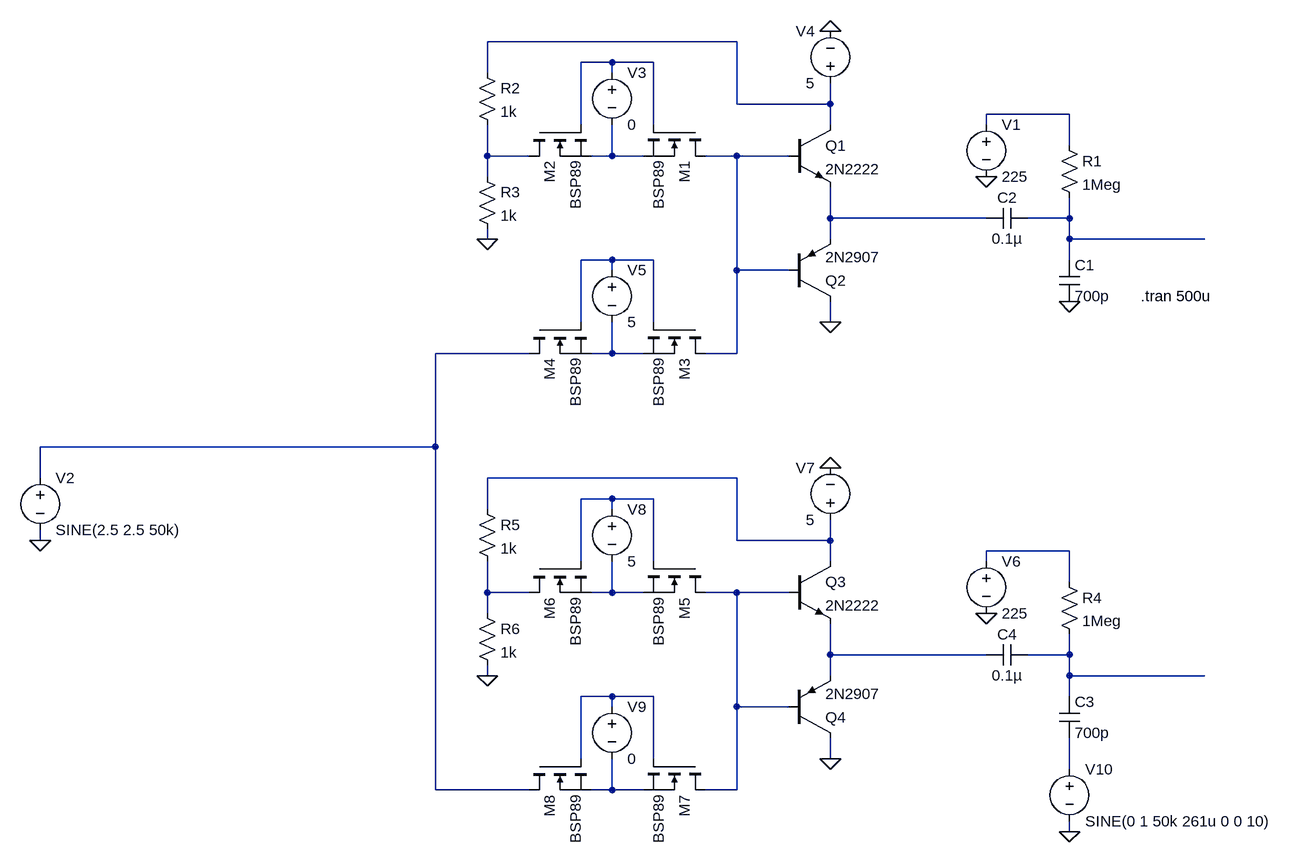
[diagram p0: schematic Ultrasonic.asc]
Ultrasonic.asc, the LTspice schematic file:
Version 4
SHEET 1 880 1064
WIRE -320 -176 -704 -176
WIRE -512 -144 -560 -144
WIRE -448 -144 -512 -144
WIRE -704 -128 -704 -176
WIRE -512 -128 -512 -144
WIRE -320 -80 -320 -176
WIRE -176 -80 -176 -112
WIRE -176 -80 -320 -80
WIRE 192 -64 64 -64
WIRE -560 -48 -560 -144
WIRE -448 -48 -448 -144
WIRE -176 -48 -176 -80
WIRE 64 -48 64 -64
WIRE 192 -16 192 -64
WIRE -704 0 -704 -48
WIRE -640 0 -704 0
WIRE -512 0 -512 -48
WIRE -512 0 -544 0
WIRE -464 0 -512 0
WIRE -320 0 -368 0
WIRE -240 0 -320 0
WIRE -704 32 -704 0
WIRE -176 96 -176 48
WIRE 64 96 -176 96
WIRE 192 96 192 64
WIRE 192 96 128 96
WIRE -704 128 -704 112
WIRE -176 128 -176 96
WIRE 192 128 192 96
WIRE 400 128 192 128
WIRE -512 160 -560 160
WIRE -448 160 -512 160
WIRE 192 160 192 128
WIRE -512 176 -512 160
WIRE -320 176 -320 0
WIRE -240 176 -320 176
WIRE -560 256 -560 160
WIRE -448 256 -448 160
WIRE -176 256 -176 224
WIRE -640 304 -784 304
WIRE -512 304 -512 256
WIRE -512 304 -544 304
WIRE -464 304 -512 304
WIRE -320 304 -320 176
WIRE -320 304 -368 304
WIRE -784 448 -784 304
WIRE -784 448 -1392 448
WIRE -1392 496 -1392 448
WIRE -320 496 -704 496
WIRE -512 528 -560 528
WIRE -448 528 -512 528
WIRE -704 544 -704 496
WIRE -512 544 -512 528
WIRE -1392 592 -1392 576
WIRE -320 592 -320 496
WIRE -176 592 -176 560
WIRE -176 592 -320 592
WIRE 192 608 64 608
WIRE -560 624 -560 528
WIRE -448 624 -448 528
WIRE -176 624 -176 592
WIRE 64 624 64 608
WIRE 192 656 192 608
WIRE -704 672 -704 624
WIRE -640 672 -704 672
WIRE -512 672 -512 624
WIRE -512 672 -544 672
WIRE -464 672 -512 672
WIRE -320 672 -368 672
WIRE -240 672 -320 672
WIRE -704 704 -704 672
WIRE -176 768 -176 720
WIRE 64 768 -176 768
WIRE 192 768 192 736
WIRE 192 768 128 768
WIRE -704 800 -704 784
WIRE -176 800 -176 768
WIRE 192 800 192 768
WIRE 400 800 192 800
WIRE -512 832 -560 832
WIRE -448 832 -512 832
WIRE 192 832 192 800
WIRE -512 848 -512 832
WIRE -320 848 -320 672
WIRE -240 848 -320 848
WIRE -560 928 -560 832
WIRE -448 928 -448 832
WIRE -176 928 -176 896
WIRE 192 944 192 896
WIRE -784 976 -784 448
WIRE -640 976 -784 976
WIRE -512 976 -512 928
WIRE -512 976 -544 976
WIRE -464 976 -512 976
WIRE -320 976 -320 848
WIRE -320 976 -368 976
WIRE 192 1040 192 1024
FLAG 64 32 0
FLAG 192 224 0
FLAG -1392 592 0
FLAG -176 -192 0
FLAG -176 256 0
FLAG -704 128 0
FLAG 64 704 0
FLAG -176 480 0
FLAG -176 928 0
FLAG -704 800 0
FLAG 192 1040 0
SYMBOL cap 176 160 R0
SYMATTR InstName C1
SYMATTR Value 700p
SYMBOL res 176 -32 R0
SYMATTR InstName R1
SYMATTR Value 1Meg
SYMBOL voltage 64 -64 R0
SYMATTR InstName V1
SYMATTR Value 225
SYMBOL cap 128 80 R90
WINDOW 0 0 32 VBottom 2
WINDOW 3 32 32 VTop 2
SYMATTR InstName C2
SYMATTR Value 0.1µ
SYMBOL voltage -1392 480 R0
WINDOW 123 0 0 Left 2
WINDOW 39 0 0 Left 2
SYMATTR InstName V2
SYMATTR Value SINE(2.5 2.5 50k)
SYMBOL npn -240 -48 R0
SYMATTR InstName Q1
SYMATTR Value 2N2222
SYMBOL pnp -240 224 M180
SYMATTR InstName Q2
SYMATTR Value 2N2907
SYMBOL voltage -176 -96 R180
WINDOW 0 24 96 Left 2
WINDOW 3 24 16 Left 2
SYMATTR InstName V4
SYMATTR Value 5
SYMBOL nmos -368 -48 R90
SYMATTR InstName M1
SYMATTR Value BSP89
SYMBOL nmos -640 -48 M90
SYMATTR InstName M2
SYMATTR Value BSP89
SYMBOL voltage -512 -144 R0
SYMATTR InstName V3
SYMATTR Value 0
SYMBOL res -720 -144 R0
SYMATTR InstName R2
SYMATTR Value 1k
SYMBOL res -720 16 R0
SYMATTR InstName R3
SYMATTR Value 1k
SYMBOL nmos -368 256 R90
SYMATTR InstName M3
SYMATTR Value BSP89
SYMBOL nmos -640 256 M90
SYMATTR InstName M4
SYMATTR Value BSP89
SYMBOL voltage -512 160 R0
SYMATTR InstName V5
SYMATTR Value 5
SYMBOL cap 176 832 R0
SYMATTR InstName C3
SYMATTR Value 700p
SYMBOL res 176 640 R0
SYMATTR InstName R4
SYMATTR Value 1Meg
SYMBOL voltage 64 608 R0
SYMATTR InstName V6
SYMATTR Value 225
SYMBOL cap 128 752 R90
WINDOW 0 0 32 VBottom 2
WINDOW 3 32 32 VTop 2
SYMATTR InstName C4
SYMATTR Value 0.1µ
SYMBOL npn -240 624 R0
SYMATTR InstName Q3
SYMATTR Value 2N2222
SYMBOL pnp -240 896 M180
SYMATTR InstName Q4
SYMATTR Value 2N2907
SYMBOL voltage -176 576 R180
WINDOW 0 24 96 Left 2
WINDOW 3 24 16 Left 2
SYMATTR InstName V7
SYMATTR Value 5
SYMBOL nmos -368 624 R90
SYMATTR InstName M5
SYMATTR Value BSP89
SYMBOL nmos -640 624 M90
SYMATTR InstName M6
SYMATTR Value BSP89
SYMBOL voltage -512 528 R0
SYMATTR InstName V8
SYMATTR Value 5
SYMBOL res -720 528 R0
SYMATTR InstName R5
SYMATTR Value 1k
SYMBOL res -720 688 R0
SYMATTR InstName R6
SYMATTR Value 1k
SYMBOL nmos -368 928 R90
SYMATTR InstName M7
SYMATTR Value BSP89
SYMBOL nmos -640 928 M90
SYMATTR InstName M8
SYMATTR Value BSP89
SYMBOL voltage -512 832 R0
SYMATTR InstName V9
SYMATTR Value 0
SYMBOL voltage 192 928 R0
WINDOW 123 0 0 Left 2
WINDOW 39 0 0 Left 2
SYMATTR InstName V10
SYMATTR Value SINE(0 1 50k 261u 0 0 10)
TEXT 302 216 Left 2 !.tran 500u

The netlist it stands for:
* Ultrasonic.asc
C1 N008 0 700p
R1 N003 N008 1Meg
V1 N003 0 225
C2 N008 N007 0.1µ
V2 N010 0 SINE(2.5 2.5 50k)
Q1 N001 N006 N007 0 2N2222
Q2 0 N006 N007 0 2N2907
V4 N001 0 5
M1 N006 N002 N005 N005 BSP89
M2 N004 N002 N005 N005 BSP89
V3 N002 N005 0
R2 N001 N004 1k
R3 N004 0 1k
M3 N006 N009 N011 N011 BSP89
M4 N010 N009 N011 N011 BSP89
V5 N009 N011 5
C3 N019 N021 700p
R4 N014 N019 1Meg
V6 N014 0 225
C4 N019 N018 0.1µ
Q3 N012 N017 N018 0 2N2222
Q4 0 N017 N018 0 2N2907
V7 N012 0 5
M5 N017 N013 N016 N016 BSP89
M6 N015 N013 N016 N016 BSP89
V8 N013 N016 5
R5 N012 N015 1k
R6 N015 0 1k
M7 N017 N020 N022 N022 BSP89
M8 N010 N020 N022 N022 BSP89
V9 N020 N022 0
V10 N021 0 SINE(0 1 50k 261u 0 0 10)
.model NPN NPN
.model PNP PNP
.lib standard.bjt
.model NMOS NMOS
.model PMOS PMOS
.lib standard.mos
.tran 500u
.backanno
.end